# Altium project Gas_Sensor.PrjPcb
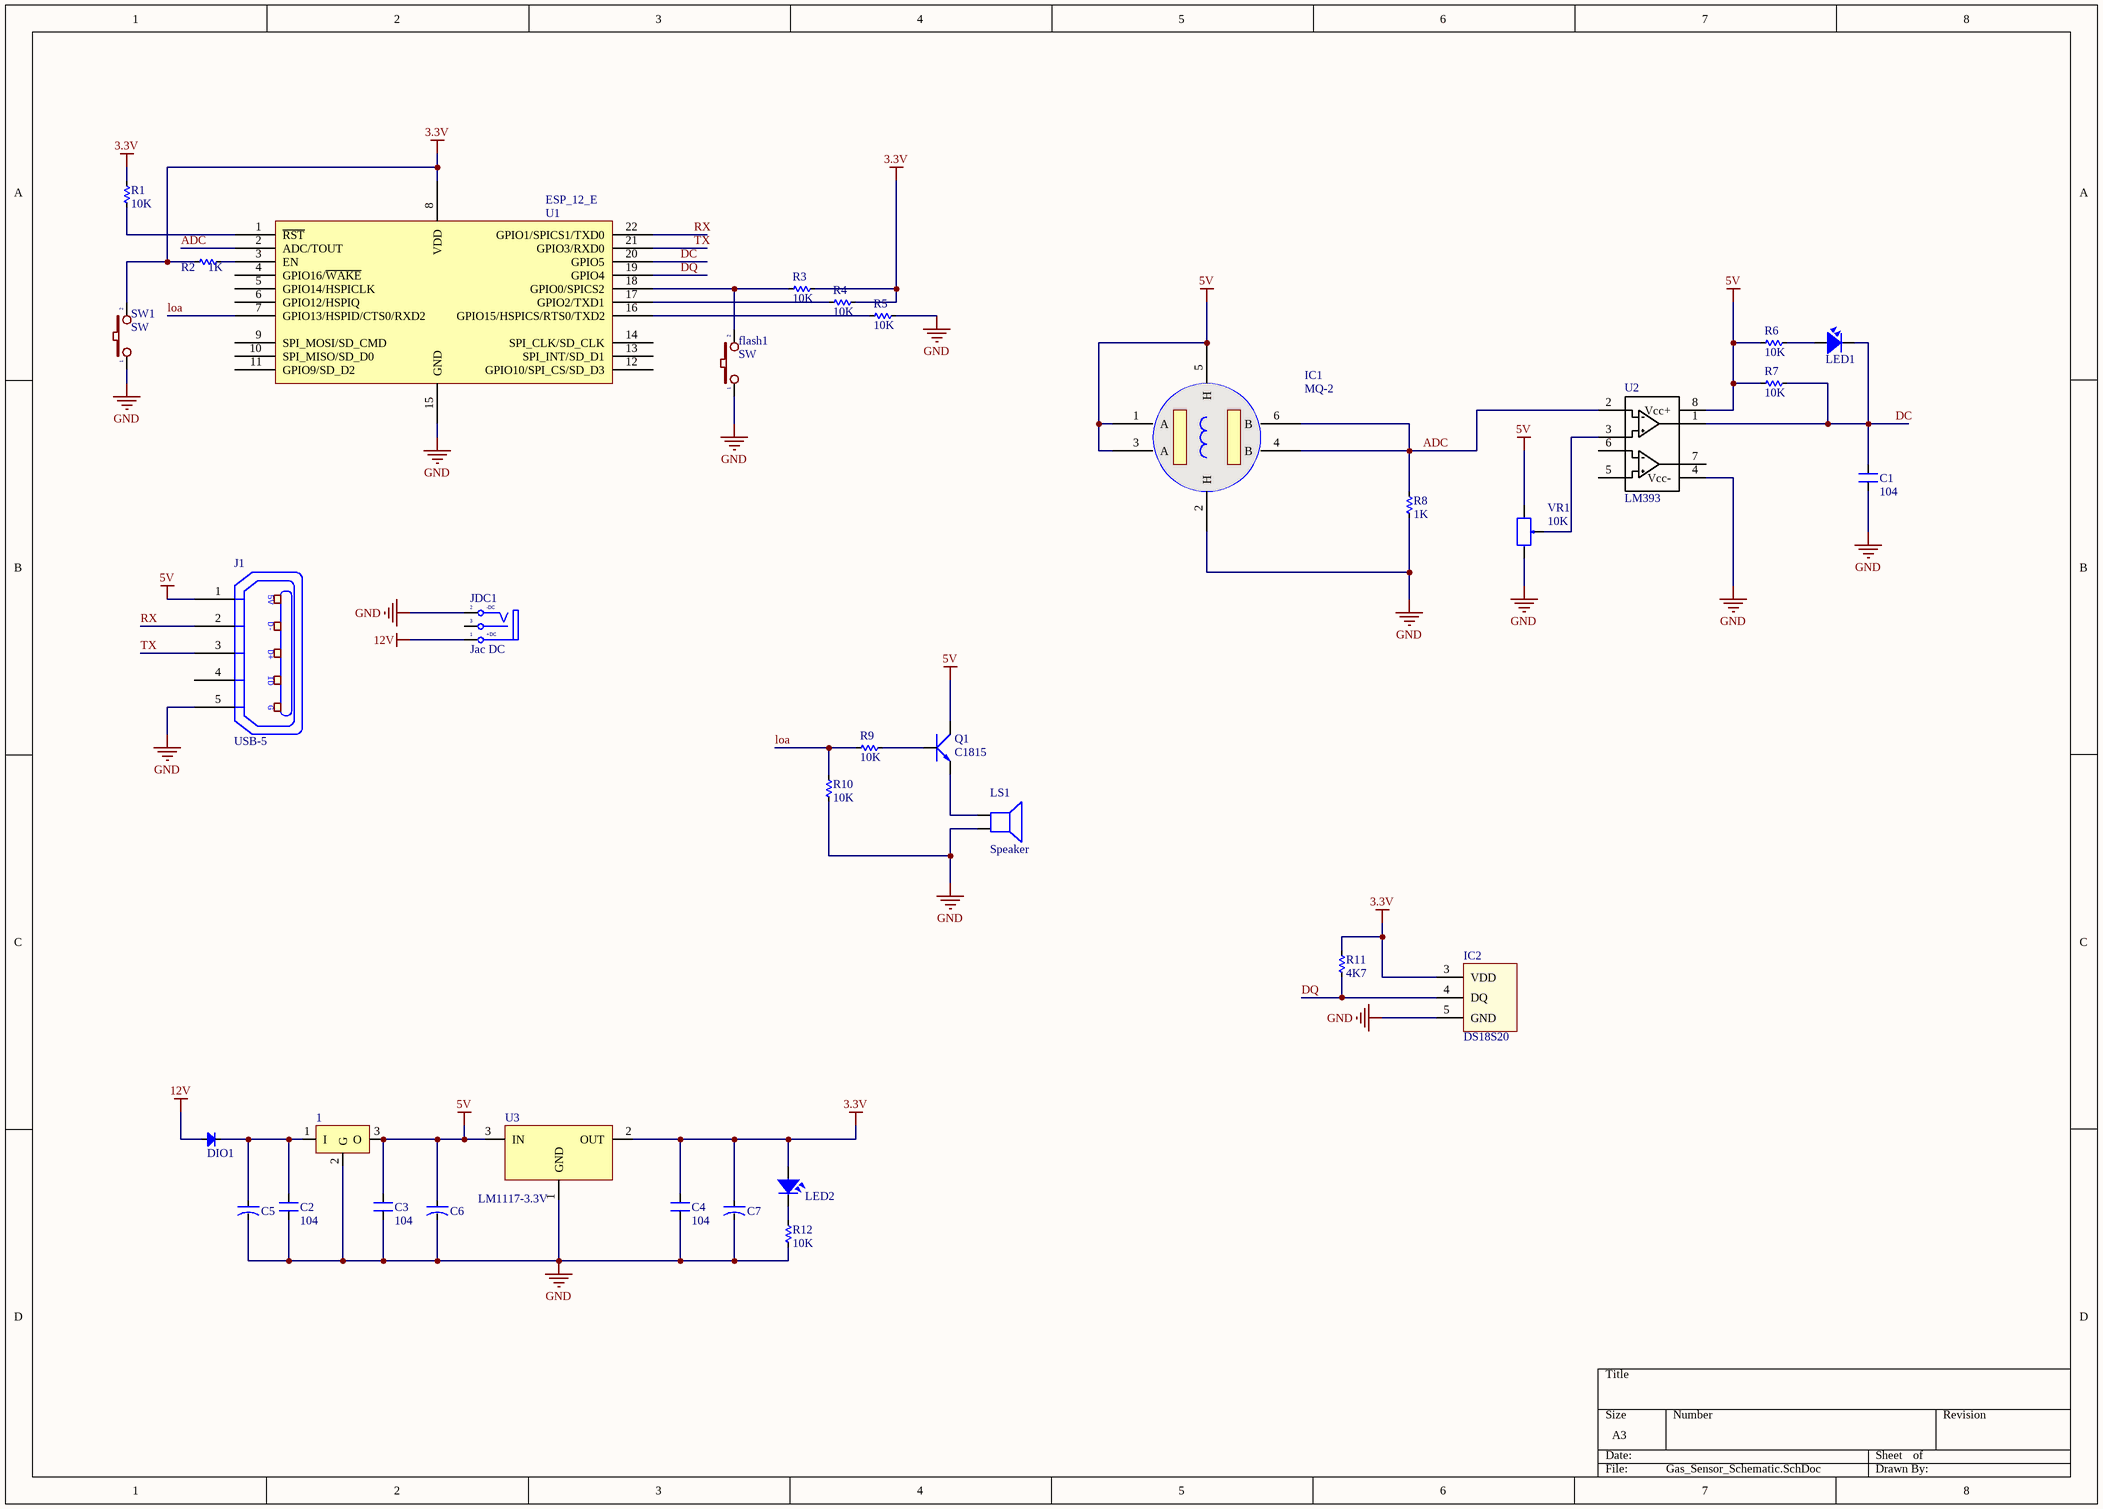
[diagram p0: Gas_Sensor_Schematic.SchDoc]
1 sheet, 35 parts. Net scope: global (net labels, ports and power ports of the same name join across sheets).
Board file: Gas_Sensor_PCB.PcbDoc

## Sheet Gas_Sensor_Schematic.SchDoc
size A3

### Parts
1  LM78xx  [TO252-123]  (value not drawn)
C1  104  [SM-CAP-0805]
C2  104  [SM-CAP-0805]
C3  104  [SM-CAP-0805]
C4  104  [SM-CAP-0805]
C5  CN-ALU-SMD  [CAP-ALU-SMD-4.5x5x1.4]  (value not drawn)
C6  CN-ALU-SMD  [CAP-ALU-SMD-4.5x5x1.4]  (value not drawn)
C7  CN-ALU-SMD  [CAP-ALU-SMD-4.5x5x1.4]  (value not drawn)
DIO1  Diode SMD  [DIO-SMD-106]  (value not drawn)
flash1  SW  [SW-DIP1]
IC1  MQ-2  [MQ-2]
IC2  DS18S20  [DS18S20]
J1  USB-5  [USB-M1]
JDC1  Jac DC  [DC3]
LED1  LED  [LED-0805-Blue]  (value not drawn)
LED2  LED  [LED-0805-Blue]  (value not drawn)
LS1  Speaker  [SPEAKER]
Q1  C1815  [SOT23B]
R1  10K  [RES-SMD-0805]
R2  1K  [RES-SMD-0805]
R3  10K  [RES-SMD-0805]
R4  10K  [RES-SMD-0805]
R5  10K  [RES-SMD-0805]
R6  10K  [RES-SMD-0805]
R7  10K  [RES-SMD-0805]
R8  1K  [RES-SMD-0805]
R9  10K  [RES-SMD-0805]
R10  10K  [RES-SMD-0805]
R11  4K7  [RES-SMD-0805]
R12  10K  [RES-SMD-0805]
SW1  SW  [SW1-SMD]
U1  ESP_12_E  [ESP_12_E]
U2  LM393  [SO8]
U3  LM1117-3.3V  [SOT223]
VR1  10K  [VR]

### Nets
3.3V: C4.2 C7.1 IC2.3(VDD) LED2.1 R1.1 R2.2 R3.1 R4.1 R11.1 SW1.2 U1.8(VDD) U3.2(OUT)
5V: 1.3(O) C3.2 C6.1 IC1.1(A) IC1.3(A) IC1.5(H) J1.1(P1) Q1.2(C) R6.1 R7.1 U2.8(Vcc+) U3.3(IN) VR1.1
12V: DIO1.1(A) JDC1.1(T)
GND: 1.2(G) C1.1 C2.1 C3.1 C4.1 C5.2 C6.2 C7.2 flash1.1 IC1.2(H) IC2.5(GND) J1.5(P5) JDC1.2(TN) LS1.2 R5.1 R8.2 R10.2 R12.2 SW1.1 U1.15(GND) U2.4(Vcc-) U3.1(GND) VR1.3
ADC: IC1.4(B) IC1.6(B) R8.1 U1.2(ADC/TOUT) U2.2
DC: C1.2 LED1.2 R7.2 U1.20(GPIO5) U2.1
DQ: IC2.4(DQ) R11.2 U1.19(GPIO4)
loa: R9.2 R10.1 U1.7(GPIO13/HSPID/CTS0/RXD2)
RX: J1.2(P2) U1.22(GPIO1/SPICS1/TXD0)
TX: J1.3(P3) U1.21(GPIO3/RXD0)
Net1_1: 1.1(I) C2.2 C5.1 DIO1.2(K)
Netflash1_2: flash1.2 R3.2 U1.18(GPIO0/SPICS2)
NetLED1_1: LED1.1 R6.2
NetLED2_2: LED2.2 R12.1
NetLS1_1: LS1.1 Q1.1(E)
NetQ1_3: Q1.3(B) R9.1
NetR1_2: R1.2 U1.1(~{RST})
NetR2_1: R2.1 U1.3(EN)
NetR4_2: R4.2 U1.17(GPIO2/TXD1)
NetR5_2: R5.2 U1.16(GPIO15/HSPICS/RTS0/TXD2)
NetU2_3: U2.3 VR1.2

Not connected (* = marked no-connect by the designer): J1 4(P4); JDC1 3(S); U1 4(GPIO16/~{WAKE}) 5(GPIO14/HSPICLK) 6(GPIO12/HSPIQ) 9(SPI_MOSI/SD_CMD) 10(SPI_MISO/SD_D0) 11(GPIO9/SD_D2) 12(GPIO10/SPI_CS/SD_D3) 13(SPI_INT/SD_D1) 14(SPI_CLK/SD_CLK); U2 5 6 7

### Notes on the sheet
- (in symbol DCIN) -DC; +DC
- (in symbol USB-5) 5V; D-; D+; ID; G

### Library data of the parts
1 = LM78xx: Positive Voltage Regulator; Note: Tab is connected to pin 3 (GND).; Published: 24-Aug-2001; LatestRevisionDate: 17-Jul-2002; LatestRevisionNote: Re-released for DXP Platform.; DatasheetVersion: Apr-1994; PackageVersion: Jul-1998; PackageReference: ISOWATT220AB; Publisher: Altium Limited; PackageDescription: TO, Thru-Hole, Vertical, Heatsink Mounted; 3 In-Line Leads; Pitch 2.54 mm; Pin sequence 1, 3, 2; ComponentLink1Description: Manufacturer Link; ComponentLink1URL: http://www.st.com/; ComponentLink2Description: Datasheet; ComponentLink2URL: http://www.st.com/stonline/products/literature/ds/2146/l78m05c.pdf
C1-C4 = CN: Value: 0,1uF/300V; Designed by: VanDungEvn
C5-C7 = CN-ALU-SMD: Polarized Capacitor (Axial); Published: 8-Jun-2000; LatestRevisionDate: 17-Jul-2002; LatestRevisionNote: Re-released for DXP Platform.; PackageReference: POLAR0.8; Publisher: Altium Limited
DIO1 = Diode SMD: Default Diode; Code - JEDEC: DO-214-AB; Value: 1N5007; Published: 8-Jun-2000; Revision: July-2002: Re-released for DXP Platform.; Publisher: Altium Limited
flash1 SW1 = SW2: Switch button 2 pin; Value: SW chip 2 pin
IC1 = MQ-2: MQ-2 GAS SENSOR
IC2 = DS18S20: High Precision  1-Wire® Digital Thermometer
J1 = USB-5: Manufacturer: FCI; Manufacturer Part Number: 10118193-0001LF; Connector Type: USB - micro B; Number of Contacts: 5; Gender: Receptacle; Specifications: USB 2.0; .Creator: MM; .Checked PCB: RF; Supplier 1: Digi-Key; RoHS: RoHS Compliant; Category: Connectors, Interconnects; Stock 1: 28642; Pricing 1: 1=0.46, 10=0.433, 25=0.3712, 50=0.3156, 100=0.3032, 250=0.27224, 500=0.25988 (USD); Packaging: Cut Tape (CT); Mounting Type: Surface Mount, Right Angle, Horizontal; Features: Shielded, Solder Retention; Ingress Protection: -; ComponentLink1URL: http://portal.fciconnect.com/Comergent//fci/drawing/10118193.pdf; ComponentLink1Description: http://portal.fciconnect.com/Comergent//fci/drawing/10118193.pdf; Supplier Part Number 1: 609-4616-1-ND; .Checked SCH: MM
JDC1 = DCIN: Jac DC input; Value: Jac DC
LED1 LED2 = LED SMD: Value: LED 3 - 5 ly 2 Colour
LS1 = Speaker: Loudspeaker; Published: 24-Mar-1999; LatestRevisionDate: 17-Jul-2002; LatestRevisionNote: Re-released for DXP Platform.; PackageReference: PIN2; Publisher: Altium Limited
Q1 = C1815: NPN 600mW, ECB; Value: C1815
R1-R12 = Res-SMD: Resistor; Manufacturer: Generic Components; Class: Passive; Published: 08/06/2000; Publisher: Altium Hobart Technology Centre
U1 = ESP_12_E: ESP-12 Wi-Fi Module by AI-Thinker; IC: ESP8266-EX; Vendor: Ai-thinker
U2 = LM393: IC DUAL COMPARATOR
U3 = LM1117: 800mA Low-Dropout Linear Regulator; Creator: Nguyen Ba Bien; Website: http://group3i.net
VR1 = VR: Var Resistor; Value: VR 10K